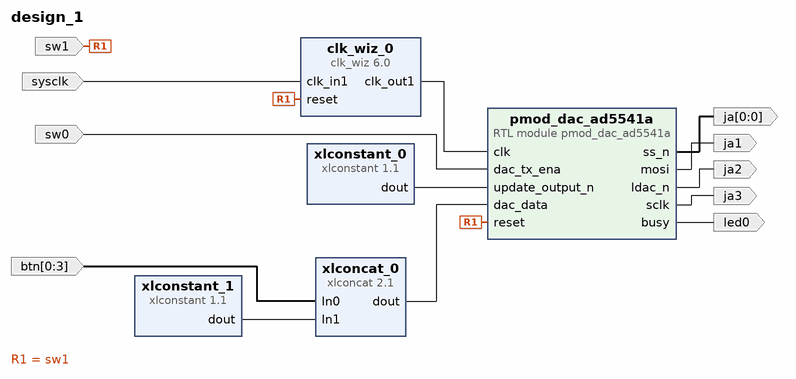
[diagram p0: block diagram of the top level]
# Vivado block design design_1, xc7z020clg400-1, Vivado 2024.1
create_bd_design design_1

create_bd_port -dir O ja2
create_bd_port -dir O ja1
create_bd_port -dir O ja3
create_bd_port -dir I -from 0 -to 3 btn
create_bd_port -dir O led0
create_bd_port -dir I -type clk sysclk
set_property -dict {CONFIG.FREQ_HZ 125000000} [get_bd_ports sysclk]
create_bd_port -dir I -type rst sw1
set_property -dict {CONFIG.POLARITY ACTIVE_HIGH} [get_bd_ports sw1]
create_bd_port -dir I sw0
create_bd_port -dir O -from 0 -to 0 ja

create_bd_cell -type ip -vlnv xilinx.com:ip:clk_wiz:6.0 clk_wiz_0
set_property -dict [list \
  CONFIG.CLKIN1_JITTER_PS 80.0 \
  CONFIG.CLKOUT1_JITTER 124.615 \
  CONFIG.CLKOUT1_PHASE_ERROR 96.948 \
  CONFIG.MMCM_CLKFBOUT_MULT_F 8.000 \
  CONFIG.MMCM_CLKIN1_PERIOD 8.000 \
  CONFIG.PRIM_IN_FREQ 125.00 \
] [get_bd_cells clk_wiz_0]
create_bd_cell -type module -reference pmod_dac_ad5541a pmod_dac_ad5541a
create_bd_cell -type ip -vlnv xilinx.com:ip:xlconstant:1.1 xlconstant_0
set_property -dict {CONFIG.CONST_VAL 0} [get_bd_cells xlconstant_0]
create_bd_cell -type ip -vlnv xilinx.com:ip:xlconstant:1.1 xlconstant_1
set_property -dict {CONFIG.CONST_VAL 3333 CONFIG.CONST_WIDTH 12} [get_bd_cells xlconstant_1]
create_bd_cell -type ip -vlnv xilinx.com:ip:xlconcat:2.1 xlconcat_0
set_property -dict {CONFIG.IN0_WIDTH 4 CONFIG.IN1_WIDTH 12 CONFIG.NUM_PORTS 2} [get_bd_cells xlconcat_0]

# ---- connections ----

connect_bd_net [get_bd_ports btn] [get_bd_pins xlconcat_0/In0]
connect_bd_net [get_bd_pins clk_wiz_0/clk_out1] [get_bd_pins pmod_dac_ad5541a/clk]
connect_bd_net -net pmod_dac_ad5541a_0_busy [get_bd_pins pmod_dac_ad5541a/busy] [get_bd_ports led0]
connect_bd_net -net pmod_dac_ad5541a_0_ldac_n [get_bd_pins pmod_dac_ad5541a/ldac_n] [get_bd_ports ja2]
connect_bd_net -net pmod_dac_ad5541a_0_mosi [get_bd_pins pmod_dac_ad5541a/mosi] [get_bd_ports ja1]
connect_bd_net -net pmod_dac_ad5541a_0_sclk [get_bd_pins pmod_dac_ad5541a/sclk] [get_bd_ports ja3]
connect_bd_net [get_bd_pins pmod_dac_ad5541a/ss_n] [get_bd_ports ja]
connect_bd_net -net reset_0_1 [get_bd_ports sw1] [get_bd_pins clk_wiz_0/reset] [get_bd_pins pmod_dac_ad5541a/reset]
connect_bd_net -net sw0_1 [get_bd_ports sw0] [get_bd_pins pmod_dac_ad5541a/dac_tx_ena]
connect_bd_net [get_bd_ports sysclk] [get_bd_pins clk_wiz_0/clk_in1]
connect_bd_net [get_bd_pins xlconcat_0/dout] [get_bd_pins pmod_dac_ad5541a/dac_data]
connect_bd_net [get_bd_pins xlconstant_0/dout] [get_bd_pins pmod_dac_ad5541a/update_output_n]
connect_bd_net [get_bd_pins xlconstant_1/dout] [get_bd_pins xlconcat_0/In1]

validate_bd_design
save_bd_design
